# EAGLE design Stim+EMG_breakout (EAGLE 7.1.0)
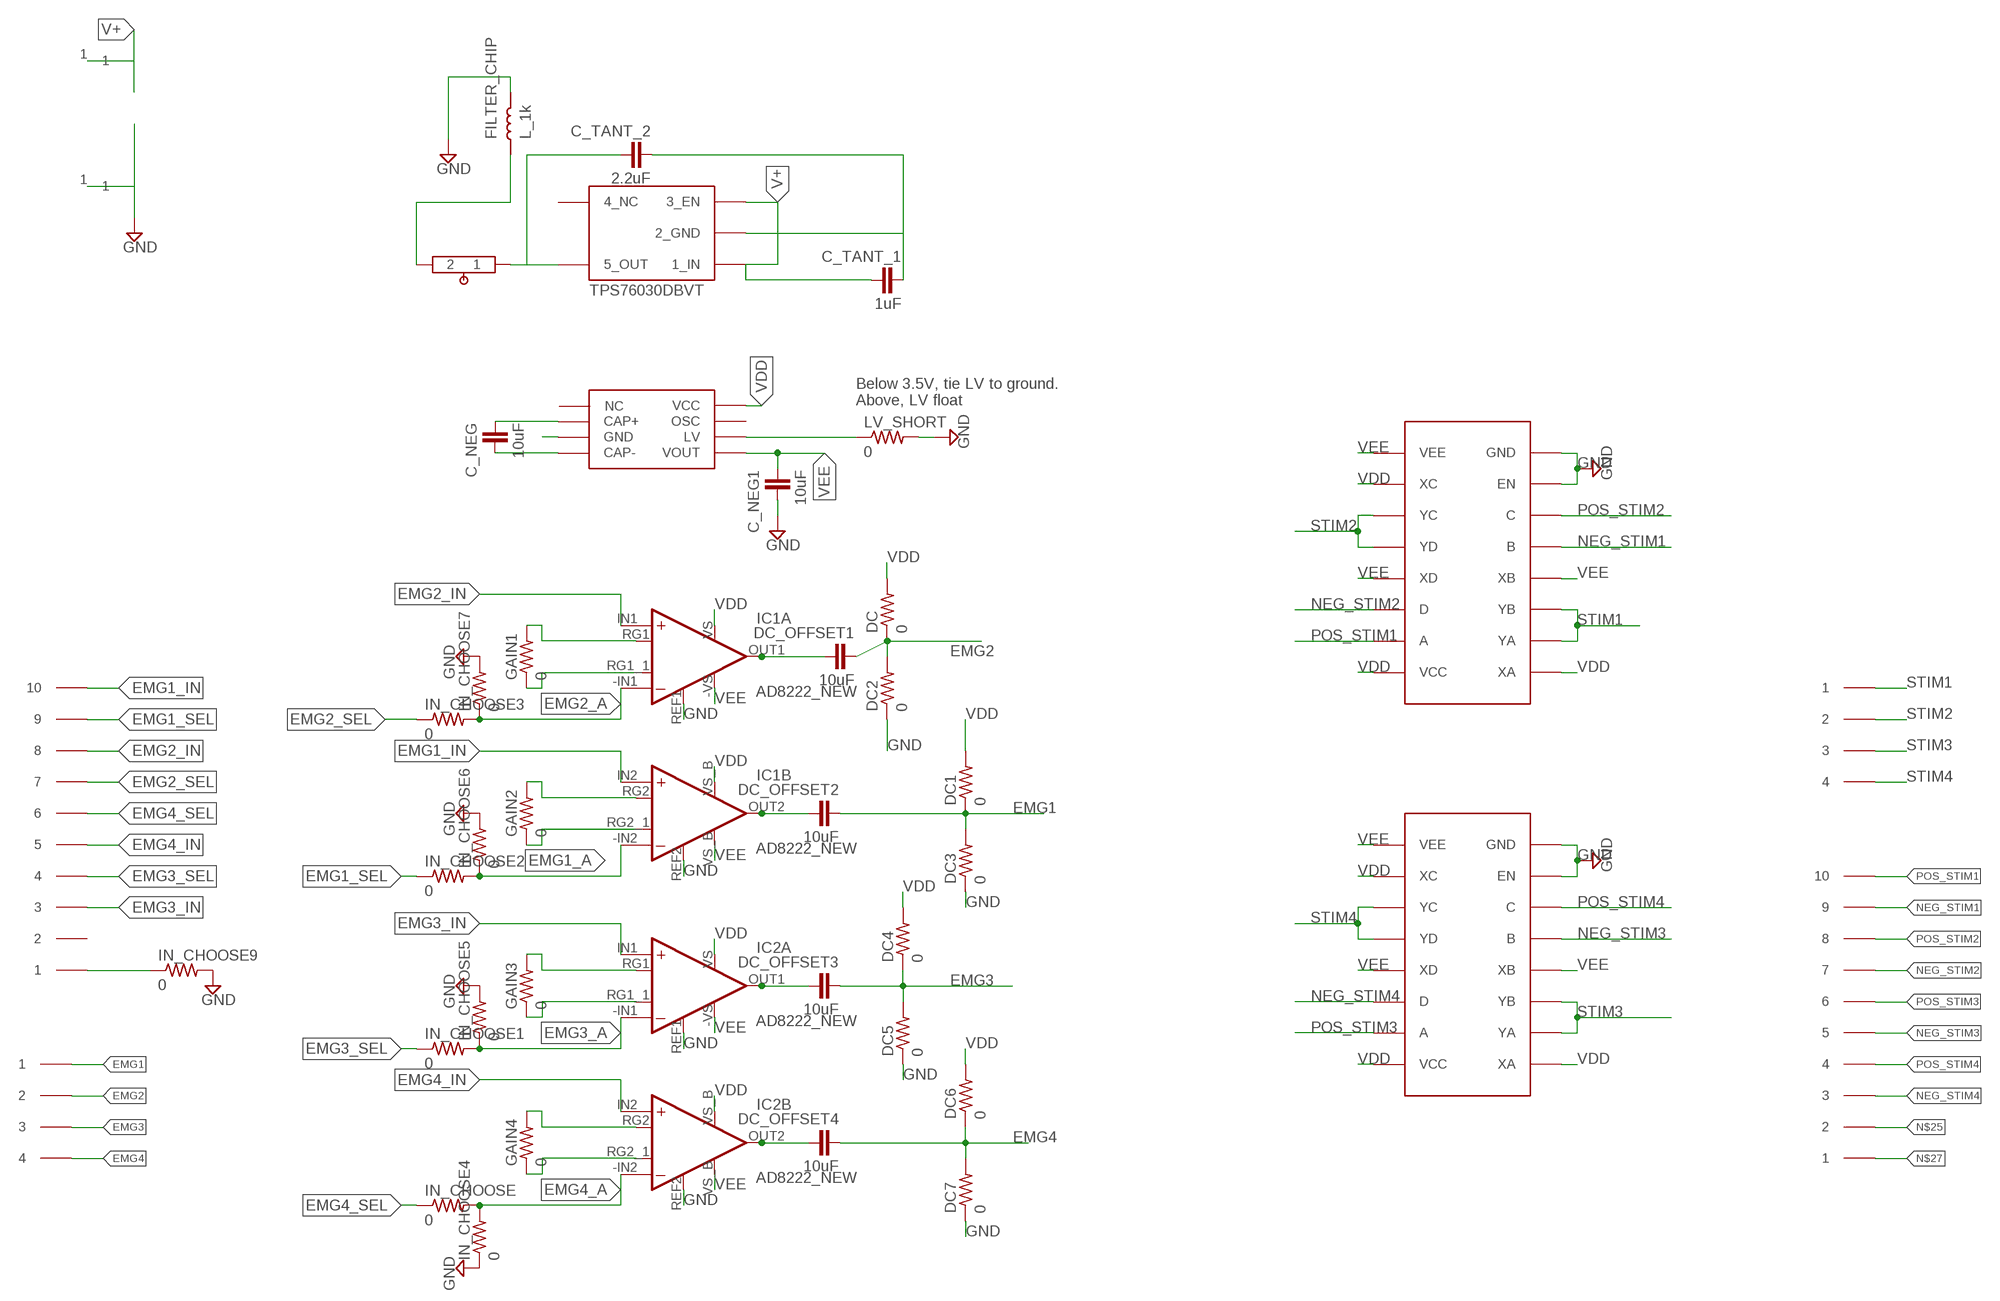
[diagram p0: schematic, sheet 1]

## Parts
C_NEG  10uF  0Y0X_C0402  [0402_R/L/C]
C_NEG1  10uF  0Y0X_C0402  [0402_R/L/C]
C_TANT_1  1uF  0Y0X_C0603  [0603_R/L/C]
C_TANT_2  2.2uF  0Y0X_C0603  [0603_R/L/C]
DC  0  0Y0X_R0402  [0402_R/L/C]
DC1  0  0Y0X_R0402  [0402_R/L/C]
DC2  0  0Y0X_R0402  [0402_R/L/C]
DC3  0  0Y0X_R0402  [0402_R/L/C]
DC4  0  0Y0X_R0402  [0402_R/L/C]
DC5  0  0Y0X_R0402  [0402_R/L/C]
DC6  0  0Y0X_R0402  [0402_R/L/C]
DC7  0  0Y0X_R0402  [0402_R/L/C]
DC_OFFSET1  10uF  0Y0X_C0402  [0402_R/L/C]
DC_OFFSET2  10uF  0Y0X_C0402  [0402_R/L/C]
DC_OFFSET3  10uF  0Y0X_C0402  [0402_R/L/C]
DC_OFFSET4  10uF  0Y0X_C0402  [0402_R/L/C]
FILTER_CHIP  L_1k  0Y0X_L0402  [0402_R/L/C]
GAIN1  0  0Y0X_R0402  [0402_R/L/C]
GAIN2  0  0Y0X_R0402  [0402_R/L/C]
GAIN3  0  0Y0X_R0402  [0402_R/L/C]
GAIN4  0  0Y0X_R0402  [0402_R/L/C]
IC1  AD8222_NEW  [QFN-16]
IC2  AD8222_NEW  [QFN-16]
IN_CHOOSE  0  0Y0X_R0201  [0201_R/L/C]
IN_CHOOSE1  0  0Y0X_R0201  [0201_R/L/C]
IN_CHOOSE2  0  0Y0X_R0201  [0201_R/L/C]
IN_CHOOSE3  0  0Y0X_R0201  [0201_R/L/C]
IN_CHOOSE4  0  0Y0X_R0201  [0201_R/L/C]
IN_CHOOSE5  0  0Y0X_R0201  [0201_R/L/C]
IN_CHOOSE6  0  0Y0X_R0201  [0201_R/L/C]
IN_CHOOSE7  0  0Y0X_R0201  [0201_R/L/C]
IN_CHOOSE9  0  0Y0X_R0201  [0201_R/L/C]
LV_SHORT  0  0Y0X_R0402  [0402_R/L/C]
U$1  FFC10POS  [FFC10POS]
U$2  FFC4POS  [FFC4POS]
U$4  TL7660  [S-PDSO-G8]
U$5  MC74HC4316A  [SOIC-16-ON-SEMI]
U$6  MC74HC4316A  [SOIC-16-ON-SEMI]
U$7  FFC10POS  [FFC10POS]
U$10  REGULATOR  [REGULATOR]
U$18  SWITCH_MANUAL  [SWITCH_MANUAL]
U$28  FFC4POS  [FFC4POS]
WIRE+  DRILL_CONNECT  [DRILL_CONNECT]
WIRE-  DRILL_CONNECT  [DRILL_CONNECT]

## Nets
EMG1: DC1.1 DC3.2 DC_OFFSET2.2 U$2.1
EMG1_A: IC1.-IN2(B:-IN) IN_CHOOSE2.2 IN_CHOOSE6.1
EMG1_IN: IC1.IN2(B:+IN) U$7.10
EMG1_SEL: IN_CHOOSE2.1 U$7.9
EMG2: DC2.2 DC.1 DC_OFFSET1.2 U$2.2
EMG2_A: IC1.-IN1(A:-IN) IN_CHOOSE3.2 IN_CHOOSE7.1
EMG2_IN: IC1.IN1(A:+IN) U$7.8
EMG2_SEL: IN_CHOOSE3.1 U$7.7
EMG3: DC4.1 DC5.2 DC_OFFSET3.2 U$2.3
EMG3_A: IC2.-IN1(A:-IN) IN_CHOOSE1.2 IN_CHOOSE5.1
EMG3_IN: IC2.IN1(A:+IN) U$7.3
EMG3_SEL: IN_CHOOSE1.1 U$7.4
EMG4: DC6.1 DC7.2 DC_OFFSET4.2 U$2.4
EMG4_A: IC2.-IN2(B:-IN) IN_CHOOSE4.2 IN_CHOOSE.2
EMG4_IN: IC2.IN2(B:+IN) U$7.5
EMG4_SEL: IN_CHOOSE.1 U$7.6
GND: C_NEG1.1 DC2.1 DC3.1 DC5.1 DC7.1 FILTER_CHIP.2 IC1.REF1(A:REF) IC1.REF2(B:REF) IC2.REF1(A:REF) IC2.REF2(B:REF) IN_CHOOSE4.1 IN_CHOOSE5.2 IN_CHOOSE6.2 IN_CHOOSE7.2 IN_CHOOSE9.2 LV_SHORT.2 U$4.3(GND) U$5.7(EN) U$5.8(GND) U$6.7(EN) U$6.8(GND) WIRE-.1
N$3: C_NEG.2 U$4.2(CAP+)
N$4: C_NEG.1 U$4.4(CAP-)
N$5: LV_SHORT.1 U$4.6(LV)
N$6: GAIN1.2 IC1.RG1(A:RG1)
N$7: GAIN1.1 IC1.RG1_1(A:RG1_1)
N$8: GAIN2.2 IC1.RG2(B:RG1)
N$9: GAIN2.1 IC1.RG2_1(B:RG1_1)
N$10: GAIN3.2 IC2.RG1(A:RG1)
N$11: GAIN3.1 IC2.RG1_1(A:RG1_1)
N$12: GAIN4.2 IC2.RG2(B:RG1)
N$13: GAIN4.1 IC2.RG2_1(B:RG1_1)
N$14: DC_OFFSET1.1 IC1.OUT1(A:OUT)
N$15: DC_OFFSET2.1 IC1.OUT2(B:OUT)
N$16: DC_OFFSET4.1 IC2.OUT2(B:OUT)
N$17: DC_OFFSET3.1 IC2.OUT1(A:OUT)
N$21: C_TANT_2.1 U$10.5(5_OUT) U$18.1
N$25: U$1.2
N$26: C_TANT_1.2 C_TANT_2.2 U$10.2(2_GND)
N$27: U$1.1
N$28: IN_CHOOSE9.1 U$7.1
NEG_STIM1: U$1.9 U$5.5(B)
NEG_STIM2: U$1.7 U$5.14(D)
NEG_STIM3: U$1.5 U$6.5(B)
NEG_STIM4: U$1.3 U$6.14(D)
POS_STIM1: U$1.10 U$5.15(A)
POS_STIM2: U$1.8 U$5.6(C)
POS_STIM3: U$1.6 U$6.15(A)
POS_STIM4: U$1.4 U$6.6(C)
STIM1: U$5.2(YA) U$5.3(YB) U$28.1
STIM2: U$5.11(YC) U$5.12(YD) U$28.2
STIM3: U$6.2(YA) U$6.3(YB) U$28.3
STIM4: U$6.11(YC) U$6.12(YD) U$28.4
V+: C_TANT_1.1 U$10.1(1_IN) U$10.3(3_EN) WIRE+.1
VDD: DC1.2 DC4.2 DC6.2 DC.2 FILTER_CHIP.1 IC1.VS(A:V+) IC1.VS_B(B:V+) IC2.VS(A:V+) IC2.VS_B(B:V+) U$4.8(VCC) U$5.1(XA) U$5.10(XC) U$5.16(VCC) U$6.1(XA) U$6.10(XC) U$6.16(VCC) U$18.2
VEE: C_NEG1.2 IC1.-VS(A:V-) IC1.-VS_B(B:V-) IC2.-VS(A:V-) IC2.-VS_B(B:V-) U$4.5(VOUT) U$5.4(XB) U$5.9(VEE) U$5.13(XD) U$6.4(XB) U$6.9(VEE) U$6.13(XD)
Unconnected: U$7.2 U$10.4(4_NC)

## Notes on the sheet
- Below 3.5V, tie LV to ground. 
  Above, LV float

## Power pins joined to a net without a drawn wire
NC: U$4.1(NC)
OSC: U$4.7(OSC)

## Library data of the parts
C_NEG C_NEG1 C_TANT_1 C_TANT_2 DC_OFFSET1-DC_OFFSET4 = CC2530_PCB_TL:0Y0X_C
DC DC1-DC7 GAIN1-GAIN4 IN_CHOOSE IN_CHOOSE1-IN_CHOOSE7 IN_CHOOSE9 LV_SHORT = CC2530_PCB_TL:0Y0X_R: Package / Case 0201 (0603 Metric)
FILTER_CHIP = CC2530_PCB_TL:0Y0X_L
IC1 IC2 = moth:AD8222_NEW: OP AMP AD8222 Dual package instrumentation amplifier
U$1 U$7 = CC2530_PCB_TL:FFC10POS: FFC Connector 10POS
U$2 U$28 = CC2530_PCB_TL:FFC4POS: FFC COnnector 4POS
U$4 = moth:TL7660
U$5 U$6 = moth:MC74HC4316A
U$10 = CC2530_PCB_TL:REGULATOR: IC REG LDO 3V 50MA SOT23-5 TPS76030DBVT
U$18 = CC2530_PCB_TL:SWITCH_MANUAL
WIRE+ WIRE- = CC2530_PCB_TL:DRILL_CONNECT

## Board
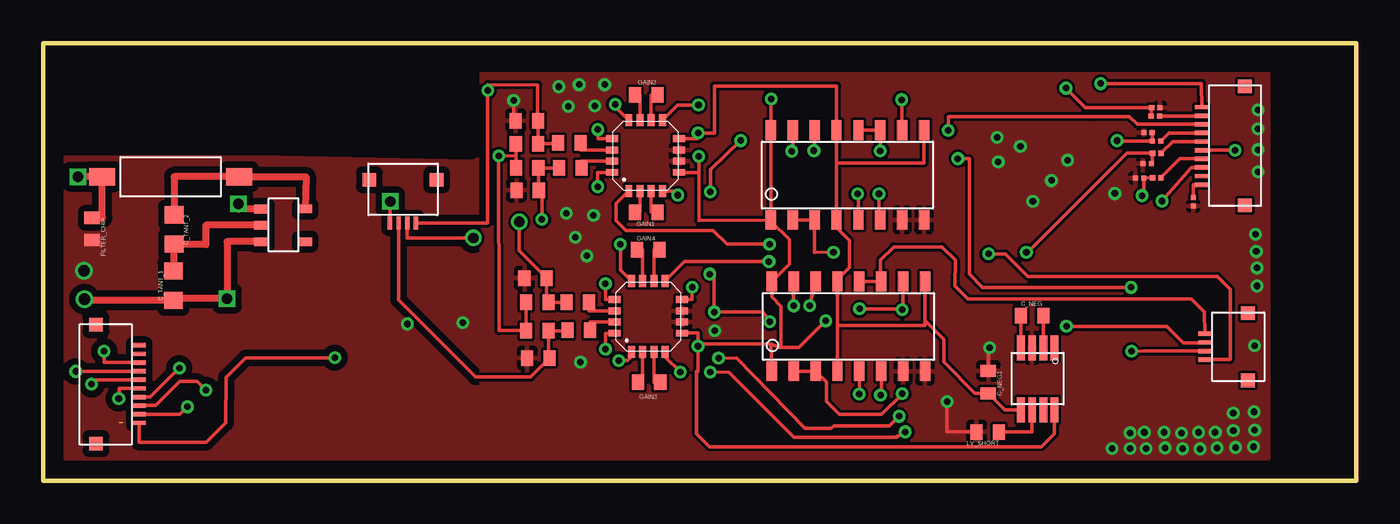
[diagram p1: board, top side]
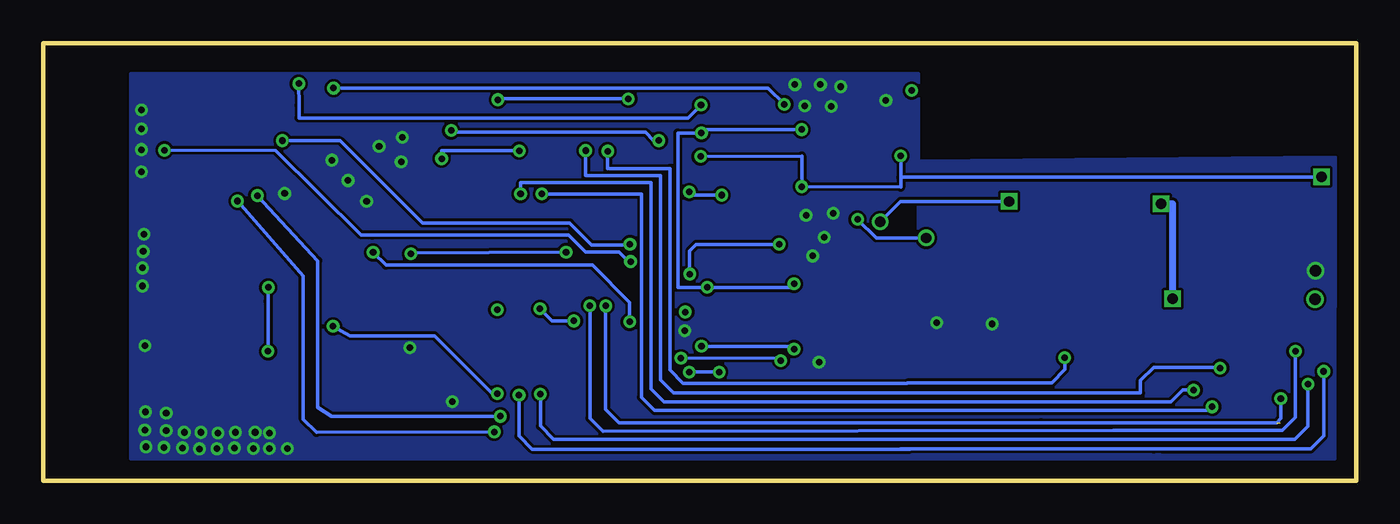
[diagram p2: board, bottom side, seen from below]

Size 76.2 x 25.4 mm. Coordinates in mm from the lower left corner, seen from the top.
Outline: 0,0 0,25.4 76.2,25.4 76.2,0 0,0
Copper layers (1*16): Top 0.0356mm / dielectric 1.5011mm / Bottom 0.0356mm
Design rules "Eagle_DRC_OSHPark": minimum track width 6mil, minimum drill 13mil, track to track 6mil, track to pad 6mil, pad to pad 6mil, via to via 6mil, smd to smd 6mil, copper to edge 15mil, drill to drill 6mil, minimum pad ring 7mil, minimum via ring 7mil, stop-mask expansion 3mil, vias tented up to drill 0mil, thermal gap 10mil

### Footprints (pad centres in the part's own frame; a part is rotated, then mirrored left to right if it is on the bottom)
0402_R/L/C = smd 0.7 x 0.9: 1 -0.65,0.001; 2 0.65,0.001
0603_R/L/C = smd 1 x 1.1: 1 -0.85,0; 2 0.85,0
QFN-16 = smd 0.7 x 0.4: -IN1 -2.05,0.975; -IN2 2.05,0.975; IN1 -2.05,-0.975; IN2 2.05,-0.975; RG1 -2.05,0.325; RG1_1 -2.05,-0.325; RG2 2.05,0.325; RG2_1 2.05,-0.325 | smd 0.4 x 0.7: -VS 0.975,1.95; -VS_B 0.975,-1.95; OUT1 -0.325,1.95; OUT2 0.325,1.95; REF1 -0.325,-1.95; REF2 0.325,-1.95; VS -0.975,1.95; VS_B -0.975,-1.95
0201_R/L/C = smd 0.3 x 0.3: 1 -0.245,-0.001; 2 0.245,-0.001
FFC10POS = smd 0.762 x 0.254: 1 -0.015,2.271; 2 -0.015,1.771; 3 -0.015,1.271; 4 -0.015,0.771; 5 -0.015,0.271; 6 -0.015,-0.229; 7 -0.015,-0.729; 8 -0.015,-1.229; 9 -0.015,-1.729; 10 -0.015,-2.229 | smd 0.8 x 0.8: P$11 -2.52,3.47; P$12 -2.52,-3.43
FFC4POS = smd 0.762 x 0.254: 1 0.04,0.742; 2 0.04,0.242; 3 0.04,-0.258; 4 0.04,-0.758 | smd 0.8 x 0.8: P$5 -2.46,1.94; P$6 -2.46,-1.96
S-PDSO-G8 = smd 0.45 x 1.45: 1 -0.975,-1.8; 2 -0.325,-1.8; 3 0.325,-1.8; 4 0.975,-1.8; 5 0.975,1.8; 6 0.325,1.8; 7 -0.325,1.8; 8 -0.975,1.8
SOIC-16-ON-SEMI = smd 0.6 x 1.15: 1 -4.445,-2.6; 2 -3.175,-2.6; 3 -1.905,-2.6; 4 -0.635,-2.6; 5 0.635,-2.6; 6 1.905,-2.6; 7 3.175,-2.6; 8 4.445,-2.6; 9 4.445,2.6; 10 3.175,2.6; 11 1.905,2.6; 12 0.635,2.6; 13 -0.635,2.6; 14 -1.905,2.6; 15 -3.175,2.6; 16 -4.445,2.6
REGULATOR = smd 0.5 x 0.8: 1 0.94,1.275; 2 0,1.275; 3 -0.95,1.275; 4 -0.95,-1.275; 5 0.95,-1.275
SWITCH_MANUAL = smd 1.524 x 1.016: 1 -4.13,0; 2 3.81,0
DRILL_CONNECT = drill 0.66 pad 1.016: 1 0,0

### Placement (x,y rotation side)
C_NEG  57.38,9.58 0 top
C_NEG1  54.84,5.72 270 top
C_TANT_1  7.56,11.31 90 top
C_TANT_2  7.59,14.58 270 top
DC  28.08,18.15 180 top
DC1  28.08,19.56 180 top
DC2  28.11,16.86 0 top
DC3  28.07,20.89 0 top
DC4  28.67,8.71 180 top
DC5  28.74,7.12 0 top
DC6  28.67,10.35 180 top
DC7  28.57,11.75 0 top
DC_OFFSET1  30.59,18.16 180 top
DC_OFFSET2  30.54,19.6 180 top
DC_OFFSET3  31.08,8.74 180 top
DC_OFFSET4  31.03,10.35 180 top
FILTER_CHIP  2.84,14.61 270 top
GAIN1  35.01,15.59 180 top
GAIN2  35.01,22.39 180 top
GAIN3  35.16,5.71 180 top
GAIN4  35.11,13.41 180 top
IC1  34.96,18.87 90 top
IC2  35.12,9.53 90 top
IN_CHOOSE  64.62,19 180 top
IN_CHOOSE1  64.62,17.58 180 top
IN_CHOOSE2  64.54,21.16 180 top
IN_CHOOSE3  64.6,19.71 180 top
IN_CHOOSE4  64.06,18.39 0 top
IN_CHOOSE5  63.61,17.57 180 top
IN_CHOOSE6  64.56,21.65 0 top
IN_CHOOSE7  64.1,20.2 180 top
IN_CHOOSE9  66.74,16.19 270 top
LV_SHORT  54.81,2.83 180 top
U$1  5.59,5.58 0 top
U$2  20.89,15 270 top
U$4  57.71,5.92 180 top
U$5  46.67,17.74 0 top
U$6  46.73,8.95 0 top
U$7  67.2,19.45 180 top
U$10  13.93,14.82 90 top
U$18  7.25,17.64 180 top
U$28  67.44,7.76 180 top
WIRE+  2.4,10.53 90 top
WIRE-  2.36,12.18 90 top

### Tracks (layer width: path | path; a pad name or v marks a point on that pad's centre or on a via)
EMG1  (via drill 0.38)
  Top 0.203: DC_OFFSET2.2 29.84,19.56 DC1.1 DC3.2 28.7,20.91 28.7,22.96 25.79,22.99 v25.8,22.64 25.79,14.96 U$2.1
EMG1_A  (via drill 0.38)
  Top 0.203: IN_CHOOSE2.2 64.31,21.18 IN_CHOOSE6.1 60.48,21.65 v59.35,22.78 | IC1.-IN2 33.2,21.7 v33.2,21.84
  Bottom 0.203: v33.2,21.84 34.14,22.78 v59.35,22.78
EMG1_IN  (via drill 0.38)
  Top 0.203: IC1.IN2 36.82,21.81 v38.03,21.81 | U$7.10 67.2,23.05 v61.36,23.05
  Bottom 0.203: v38.03,21.81 38.78,21.05 61.34,21.05 61.34,21.77 v61.36,23.05
EMG1_SEL
  Top 0.203: U$7.9 67.2,21.16 IN_CHOOSE2.1
EMG2  (via drill 0.38, 0.6)
  Top 0.203: v28.94,15.17 28.94,16.69 DC2.2 28.76,18.12 DC.1 29.93,18.15 DC_OFFSET1.2 | U$2.2 21.13,14.08 v24.96,14.08
  Bottom 0.203: v24.96,14.08 27.86,14.08 v28.94,15.17
EMG2_A  (via drill 0.38)
  Top 0.203: IC1.-IN1 33.24,16.07 33.24,15.11 33.82,14.52 38.88,14.52 39.68,13.72 v42.15,13.72 | IN_CHOOSE7.1 64.36,20.28 IN_CHOOSE3.2 62.33,19.71 v62.31,19.74
  Bottom 0.203: v42.15,13.72 42.19,13.68 44.37,13.68 45.64,14.96 54.19,14.96 58.97,19.74 v62.31,19.74
EMG2_IN  (via drill 0.38)
  Top 0.203: U$7.8 63.48,20.69 63.02,21.14 60.91,21.14 60.74,21.12 52.52,21.13 v52.52,20.32 | v40.47,19.74 38.71,18.06 v38.71,16.76 | v36.83,16.58 36.59,16.82 IC1.IN1
  Bottom 0.203: v52.52,20.32 52.41,20.22 41.26,20.22 40.78,19.74 v40.47,19.74 | v38.71,16.76 38.58,16.58 v36.83,16.58
EMG2_SEL
  Top 0.203: IN_CHOOSE3.1 65.31,20.18 U$7.7
EMG3
  Top 0.203: DC_OFFSET3.2 30.43,8.69 29.43,8.69 29.43,8.71 DC4.1 29.32,7.12 DC5.2 28.28,6.02 25.11,6.02 20.63,10.49 U$2.3
EMG3_A  (via drill 0.38)
  Top 0.203: IN_CHOOSE1.2 IN_CHOOSE5.1 63.88,16.54 v63.77,16.54 | IC2.-IN1 34.14,7.2 33.91,6.97 v33.4,6.97 | v39.19,7.11 40.22,7.12 44.2,3.03 45.72,3.03 45.87,3.19 49.12,3.19 v49.66,3.73
  Bottom 0.203: v33.4,6.97 33.55,7.12 v39.19,7.11 | v49.66,3.73 59.46,3.73 60.27,4.25 60.27,12.75 v63.77,16.54
EMG3_IN  (via drill 0.38)
  Top 0.203: IC2.IN1 36.09,7.18 v36.98,6.3 | v38.71,6.3 39.8,6.27 43.56,2.5 49.49,2.5 v50.02,2.83 | v64.92,16.23 66.63,18.18 U$7.3
  Bottom 0.203: v36.98,6.3 38.96,6.3 v38.71,6.3 | v50.02,2.83 60.34,2.79 61.11,3.56 61.11,11.88 v64.92,16.23
EMG3_SEL
  Top 0.203: IN_CHOOSE1.1 65.96,18.68 U$7.4
EMG4  (via drill 0.6)
  Top 0.203: DC_OFFSET4.2 DC6.1 29.22,10.35 DC7.2 27.63,13.35 v27.63,15.03 | U$2.4 20.13,16.19 v20.14,16.2
  Bottom 0.203: v20.14,16.2 26.45,16.2 v27.63,15.03
EMG4_A  (via drill 0.38)
  Top 0.203: IN_CHOOSE4.2 64.37,18.38 IN_CHOOSE.2 62.89,19.02 57.14,13.28 v57.05,13.25 | v42.17,9.22 41.76,9.79 v38.94,9.79 38.94,11.89 v38.69,11.99 | IC2.-IN2 33.5,12.22 v33.5,13.71
  Bottom 0.203: v33.5,13.71 38.3,13.71 38.69,13.33 v38.69,11.99 | v57.05,13.25 56.3,12.5 44.33,12.5 42.17,10.34 v42.17,9.22
EMG4_IN  (via drill 0.38)
  Top 0.203: IC2.IN2 37.23,12.71 v42.11,12.71 | v69.16,19.17 v69.16,19.18 U$7.5
  Bottom 0.203: v42.11,12.71 42.2,12.8 42.33,12.8 42.78,13.26 44.72,13.26 45.71,14.24 57.08,14.24 57.74,14.26 62.7,19.16 v69.16,19.17
EMG4_SEL
  Top 0.203: U$7.6 65.54,19.68 IN_CHOOSE.1
GND  (via drill 0.38)
  Top 0.203: DC3.1 27.3,20.89 v27.3,22.06 | LV_SHORT.2 52.45,2.83 v52.45,4.58 | v54.91,7.71 54.84,7.71 C_NEG1.1
  other vias: 24.35,9.17 21.14,9.09 30.88,14.13 29.92,22.87 31.1,22.99 32.58,22.99 30.47,21.71 32.01,21.74 67.12,1.84 66.11,1.85 70.23,1.96 31.54,13.04 38.97,8.71 30.36,15.52 31.94,15.4 31.18,6.87 69.18,1.93 70.39,13.3 68.12,1.9 70.3,2.93 70.27,3.99 65.09,1.9 64.01,1.86 63.07,1.86 62.02,1.86 62.18,16.67 63.07,2.77 63.9,2.8 65.05,2.8 66.06,2.76 67.04,2.8 68.01,2.8 69.06,2.91 69.06,3.92 70.43,12.35 70.36,14.3 70.43,11.3 70.28,7.83 70.49,21.52 70.49,20.42 70.49,19.21 70.49,17.93 55.42,18.5 55.35,19.93 57.43,16.22 58.51,17.42 59.44,18.6 56.7,19.41
  pour Top (isolate 0.381, no thermals): 13.73,18.77 1.3,18.77 1.27,1.27 25.4,1.27 25.4,12.19 25.35,18.73 24.94,18.54 24.89,18.54
  pour Bottom (no thermals): 1.23,18.77 1.27,1.27 25.4,1.27 25.4,18.54
  pour Bottom: 25.4,1.27 71.12,1.27 71.12,23.62 25.4,23.62
  pour Top: 71.12,1.27 71.12,23.62 25.4,23.62 25.4,1.27
N$3
  Top 0.203: C_NEG.2 U$4.2
N$4
  Top 0.203: C_NEG.1 U$4.4
N$5
  Top 0.203: U$4.6 57.38,2.83 LV_SHORT.1
N$6
  Top 0.203: IC1.RG1 34.63,15.59 GAIN1.2
N$7
  Top 0.203: IC1.RG1_1 35.28,15.59 GAIN1.1
N$8
  Top 0.203: IC1.RG2 34.63,22.39 GAIN2.2
N$9
  Top 0.203: IC1.RG2_1 35.28,22.39 GAIN2.1
N$10
  Top 0.203: GAIN3.2 34.79,5.71 IC2.RG1
N$11
  Top 0.203: GAIN3.1 35.44,5.71 IC2.RG1_1
N$12
  Top 0.203: 34.9,11.7 34.9,11.58 IC2.RG2 34.79,13.41 GAIN4.2
N$13
  Top 0.203: GAIN4.1 35.44,13.41 IC2.RG2_1
N$14
  Top 0.203: DC_OFFSET1.1 31.24,18.54 IC1.OUT1
N$15
  Top 0.203: DC_OFFSET2.1 31.19,19.19 IC1.OUT2
N$16
  Top 0.203: IC2.OUT2 31.68,9.86 DC_OFFSET4.1
N$17
  Top 0.203: IC2.OUT1 31.73,9.21 DC_OFFSET3.1
N$21
  Top 0.406: C_TANT_2.1 7.59,17.64 U$18.1 15.25,17.64 U$10.5
N$26
  Top 0.406: C_TANT_1.2 7.56,13.73 C_TANT_2.2 7.59,13.69 9.44,13.69 9.44,14.82 U$10.2
N$28
  Top 0.203: U$7.1 66.74,17.18 IN_CHOOSE9.1
NEG_STIM1  (via drill 0.38)
  Top 0.203: U$5.5 47.3,16.64 v47.26,16.64 | U$1.9 7.92,3.84 v8.37,4.28
  Bottom 0.203: v47.26,16.64 41.48,16.64 41.48,4.83 40.72,4.07 8.58,4.07 v8.37,4.28
NEG_STIM2  (via drill 0.38)
  Top 0.203: U$5.14 44.77,19.18 44.74,19.18 44.74,19.16 v44.72,19.16 | U$1.7 6.22,4.85 v7.9,6.53
  Bottom 0.203: v44.72,19.16 44.72,17.7 40.38,17.7 40.38,5.86 39.62,5.1 21.95,5.1 21.95,5.08 12.52,5.08 12.52,5.82 11.76,6.58 7.9,6.58 v7.9,6.53
NEG_STIM3  (via drill 0.38)
  Top 0.203: U$6.5 v47.36,5.02 v47.35,5.02 | v2.81,5.59 2.81,5.85 U$1.5
  Bottom 0.203: v47.35,5.02 47.35,3.17 46.59,2.4 25.97,2.4 25.96,2.4 25,2.4 24.84,2.39 3.57,2.39 2.81,3.15 v2.81,5.59
NEG_STIM4  (via drill 0.38)
  Top 0.203: U$6.14 44.84,11.55 v44.47,10.16 | v3.54,7.51 3.54,6.85 U$1.3
  Bottom 0.203: v44.47,10.16 44.47,3.62 43.71,2.86 14.11,2.9 4.3,2.9 3.54,3.67 v3.54,7.51
POS_STIM1  (via drill 0.38)
  Top 0.203: U$5.15 43.49,19.12 v43.44,19.12 | U$1.10 5.57,2.21 9.46,2.21 10.6,3.35 10.61,5.99 11.75,7.13 v16.92,7.13
  Bottom 0.203: v43.44,19.12 43.44,18.12 39.84,18.12 39.84,6.41 39.07,5.65 26.07,5.65 26.05,5.67 17.68,5.67 16.92,6.44 v16.92,7.13
POS_STIM2  (via drill 0.38)
  Top 0.203: U$5.6 48.5,15.14 v48.5,16.64 | U$1.8 5.57,4.37 6.52,4.37 7.92,5.77 8.93,5.77 v9.44,5.26
  Bottom 0.203: v48.5,16.64 48.5,17.3 40.94,17.3 40.94,5.32 40.18,4.56 10.78,4.56 10.08,5.26 v9.44,5.26 | v9.44,5.26
POS_STIM3  (via drill 0.38)  (1 unrouted)
  Top 0.203: U$6.15 v43.55,10.14 | U$1.6 4.4,5.35 4.4,4.78 v4.39,4.76
  Bottom 0.203: v43.55,10.14 43.55,4.13 42.79,3.37 18.31,3.37 18.31,3.36 4.63,3.36 4.39,3.61 v4.39,4.76
POS_STIM4  (via drill 0.38)
  Top 0.203: U$6.6 48.63,4.96 v48.59,4.96 | v1.9,6.34 5.57,6.34 U$1.4
  Bottom 0.203: v48.59,4.96 48.59,2.59 47.83,1.82 26.47,1.82 | 26.47,1.82 25.91,1.82 | 26.47,1.82 26.46,1.84 11.76,1.84 11.25,1.84 2.66,1.84 1.9,2.6 v1.9,6.34
STIM1  (via drill 0.38)
  Top 0.203: U$5.2 U$5.3 44.77,13.25 v45.86,13.26 | v54.86,13.16 55.83,13.16 57.13,11.86 68.12,11.86 68.88,11.1 68.88,7.03 U$28.1
  Bottom 0.203: v45.86,13.26 54.8,13.22 v54.86,13.16
STIM2  (via drill 0.38)
  Top 0.203: U$5.12 U$5.11 48.59,20.34 v48.58,19.15 | v53.08,18.69 53.74,18.69 53.74,11.98 54.5,11.22 63.15,11.22 v63.13,11.21 | v63.15,7.51 63.86,7.52 U$28.2
  Bottom 0.203: v48.58,19.15 53.07,19.15 v53.08,18.69 | v63.13,11.21 63.15,10.4 v63.15,7.51
STIM3  (via drill 0.38)
  Top 0.203: U$6.2 U$6.3 45.44,5.73 45.44,4.6 46.2,3.84 48.65,3.84 v49.85,5.05 | v59.38,8.96 65.22,8.94 66.17,7.98 67.36,7.98 U$28.3
  Bottom 0.203: v49.85,5.05 50.12,5.05 53.49,8.41 58.37,8.41 v59.38,8.96
STIM4
  Top 0.203: U$6.12 U$6.11 48.59,11.59 48.59,12.8 49.35,13.56 52.16,13.56 52.92,12.8 52.91,11.31 53.67,10.54 66.62,10.54 67.38,9.79 U$28.4
V+  (via drill 0.6)
  Top 0.406: U$10.1 11.32,15.76 v11.32,16.08 | WIRE+.1 2.4,10.46 C_TANT_1.1 7.56,10.56 v10.67,10.56 10.67,13.87 U$10.3
  Bottom 0.406: v11.32,16.08 10.67,16.08 v10.67,10.56
VDD  (via drill 0.38, 0.6)
  Top 0.203: DC.2 DC1.2 27.43,18.88 v26.44,18.85 26.45,8.71 DC4.2 DC6.2 | IC1.VS_B 38.06,17.89 v38.05,18.82 38.05,15.11 U$5.1 | v32.18,17.07 32.18,17.89 IC1.VS | IC2.VS_B 37.07,8.57 38,8.57 v38,7.8 | v32.63,7.63 32.63,8.55 IC2.VS | v38,7.8 38,6.35 37.92,6.35 37.92,2.73 38.68,1.96 57.92,1.96 58.68,2.73 U$4.8 | U$5.1 42.28,15.14 | U$5.16 42.18,20.34 | 42.23,7.95 U$6.1 | U$6.10 49.9,9.92 v49.85,9.92 49.8,9.97 v47.37,9.97 | U$5.1 U$5.16 | U$5.10 49.84,21.41 v49.81,22.11 | v42.24,22.16 42.24,20.34 U$5.16 | 42.23,11.55 U$6.16 | v38,7.8 37.95,7.95 42.23,7.95 | U$5.1 42.23,15.05 43.29,13.98 43.29,12.56 U$6.16 | 42.23,7.95 42.72,7.72 | 42.72,7.72 43.85,7.72 v45.4,9.27 | U$6.16 42.28,10.64 42.8,10.12 42.8,7.8 42.72,7.72
  Top 0.406: FILTER_CHIP.1 3.44,15.26 U$18.2 v2.02,17.64 v2.02,17.65
  Bottom 0.203: v38.05,18.82 32.18,18.85 v32.18,17.07 26.44,17.04 26.44,17.62 | v26.44,18.85 26.44,17.62 | v38,7.8 32.63,7.8 v32.63,7.63 | v49.81,22.11 49.81,22.16 v42.24,22.16 | v45.4,9.27 46.67,9.27 v47.37,9.97 | 26.44,17.62 2.02,17.62 v2.02,17.64
VEE  (via drill 0.38)
  Top 0.203: IC1.-VS 32.19,19.84 v32.19,20.38 | IC1.-VS_B 38,19.84 v38,20.18 38.95,20.18 38.95,22.9 46.03,22.9 U$5.13 46.03,18.43 | IC2.-VS_B 37.66,10.51 v37.66,11.22 | v32.63,11.43 32.63,10.51 IC2.-VS | U$5.9 51.12,18.43 46.03,18.43 | U$6.4 46.09,9.01 | 46.09,9.01 U$6.13 46.03,11.61 46.8,12.37 46.8,13.93 46.03,14.7 U$5.4 46.03,18.43 | U$6.9 51.17,9.28 | 51.17,9.28 51.17,9.01 46.09,9.01 | U$4.5 55.8,4.12 C_NEG1.2 54.07,5.07 52.25,6.89 52.25,8.2 51.17,9.28
  Bottom 0.203: v32.19,20.38 38,20.38 v38,20.18 39.37,20.18 39.37,11.22 v37.66,11.22 32.63,11.22 v32.63,11.43

### Text on the board
tValues: EMG1 | Voltage Stimulation / EMG recording board / Kevin Keller Dec 2015 / iBionics Lab | EMG2 | AD8222 | Stim Switch | EMG4 | EMG3 | DC Offset / V divider | EMG / Output | EMG Electrode Input / Select input with 0 ohm | DC Offset / V divider | Stim Switch | AD8222 | Stim4 | Stim3 | Stimulation / Control | Stim2 | Stim1 | V Inverter